# EAGLE schematic Pinguino-PIC18F2550 (EAGLE 7.6.0)
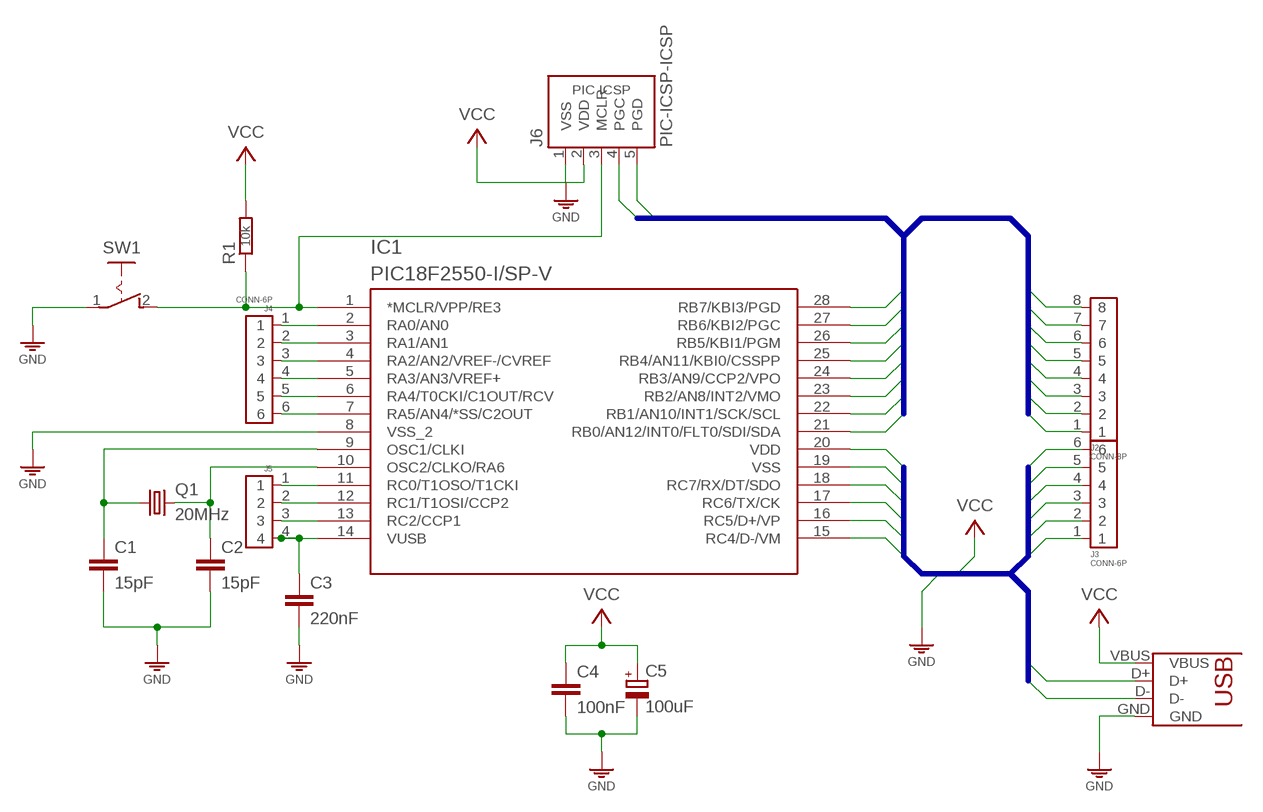
[diagram p0: schematic, sheet 1]

## Parts
C1  15pF  C025-015X024  [C025-015X024]
C2  15pF  C025-015X024  [C025-015X024]
C3  220nF  C075-032X103  [C075-032X103]
C4  100nF  C025-015X024  [C025-015X024]
C5  100uF  CPOLE2,5-4  [E2,5-4]
IC1  PIC18F2550-I/SP-V  [DIL28-3/V]
J1  USB-PRINT  [USB-B-PRINT]
J2  CONN-8P  [CONN-8P]
J3  CONN-6P  [CONN-6P]
J4  CONN-6P  [CONN-6P]
J5  CONN-4P-4P  [CONN-4P]
J6  PIC-ICSP-ICSP  [PIC-ICSP]
Q1  20MHz  CRYSTALHC49  [HC49]
R1  10k  R0204/10  [0204/10]
SW1  PB-1P-1T  [PB-1P1T]

## Nets
N$1: IC1.1(*MCLR/VPP/RE3) J6.3(MCLR) R1.1 SW1.2(S)
N$2: C2.1 IC1.10(OSC2/CLKO/RA6) Q1.2
N$3: C1.1 IC1.9(OSC1/CLKI) Q1.1
N$5: C3.1 IC1.14(VUSB) J5.4
N$17: IC1.3(RA1/AN1) J4.2
N$18: IC1.2(RA0/AN0) J4.1
N$19: IC1.4(RA2/AN2/VREF-/CVREF) J4.3
N$20: IC1.5(RA3/AN3/VREF+) J4.4
N$21: IC1.6(RA4/T0CKI/C1OUT/RCV) J4.5
N$22: IC1.7(RA5/AN4/*SS/C2OUT) J4.6
N$23: IC1.12(RC1/T1OSI/CCP2) J5.2
N$24: IC1.11(RC0/T1OSO/T1CKI) J5.1
N$25: IC1.13(RC2/CCP1) J5.3
RB0: IC1.21(RB0/AN12/INT0/FLT0/SDI/SDA) J2.1
RB1: IC1.22(RB1/AN10/INT1/SCK/SCL) J2.2
RB2: IC1.23(RB2/AN8/INT2/VMO) J2.3
RB3: IC1.24(RB3/AN9/CCP2/VPO) J2.4
RB4: IC1.25(RB4/AN11/KBI0/CSSPP) J2.5
RB5: IC1.26(RB5/KBI1/PGM) J2.6
RB6: IC1.27(RB6/KBI2/PGC) J2.7 J6.4(PGC)
RB7: IC1.28(RB7/KBI3/PGD) J2.8 J6.5(PGD)
RC4: IC1.15(RC4/D-/VM) J1.D- J3.1
RC5: IC1.16(RC5/D+/VP) J1.D+ J3.2
RC6: IC1.17(RC6/TX/CK) J3.3
RC7: IC1.18(RC7/RX/DT/SDO) J3.4
VDD: C4.1 C5.+ IC1.20(VDD) J1.VBUS J3.6 J6.2(VDD) R1.2 ; supply symbol labelled VCC
VSS: C1.2 C2.2 C3.2 C4.2 C5.- IC1.8(VSS_2) IC1.19(VSS) J1.GND J3.5 J6.1(VSS) SW1.1(P) ; supply symbol labelled GND

## Buses
RB[0..7]
RC[4..7],VSS,VDD

## Library data of the parts
C1-C4 = c:C: CAPACITOR, European symbol
C5 = c:CPOL: POLARIZED CAPACITOR, European symbol
IC1 = mcu:PIC18F2550-I/SP
J1 = usb:USB: USB Connectors USB-B-PTH is fully proven SKU : PRT-00139 USB-miniB is fully proven SKU : PRT-00587 USB-A-PCB is untested. USB-A-H is throughly reviewed, but untested. Spark Fun Electronics SKU : PRT-00437 USB-B-SMT is throughly reviewed, but untested. Needs silkscreen touching up. USB-A-S has not been used/tested USB-MB-H has not been used/tested
J2 = pinconn:CONN-8P
J3 J4 = pinconn:CONN-6P
J5 = pinconn:CONN-4P
J6 = pinconn:PIC-ICSP
Q1 = q:CRYSTAL
R1 = r:R: RESISTOR, European symbol
SW1 = sw:PB-1P-1T

## Net classes
0 default: width 0.61 mm